# EasyEDA schematic SCH_zafir-project_2024-11-25.json
TITLE: Sheet_1; REV: 1.0; Date: 2024-11-25; Sheet: 1/1; Drawn By: muhammadzeeshan0668; Company: Your Company
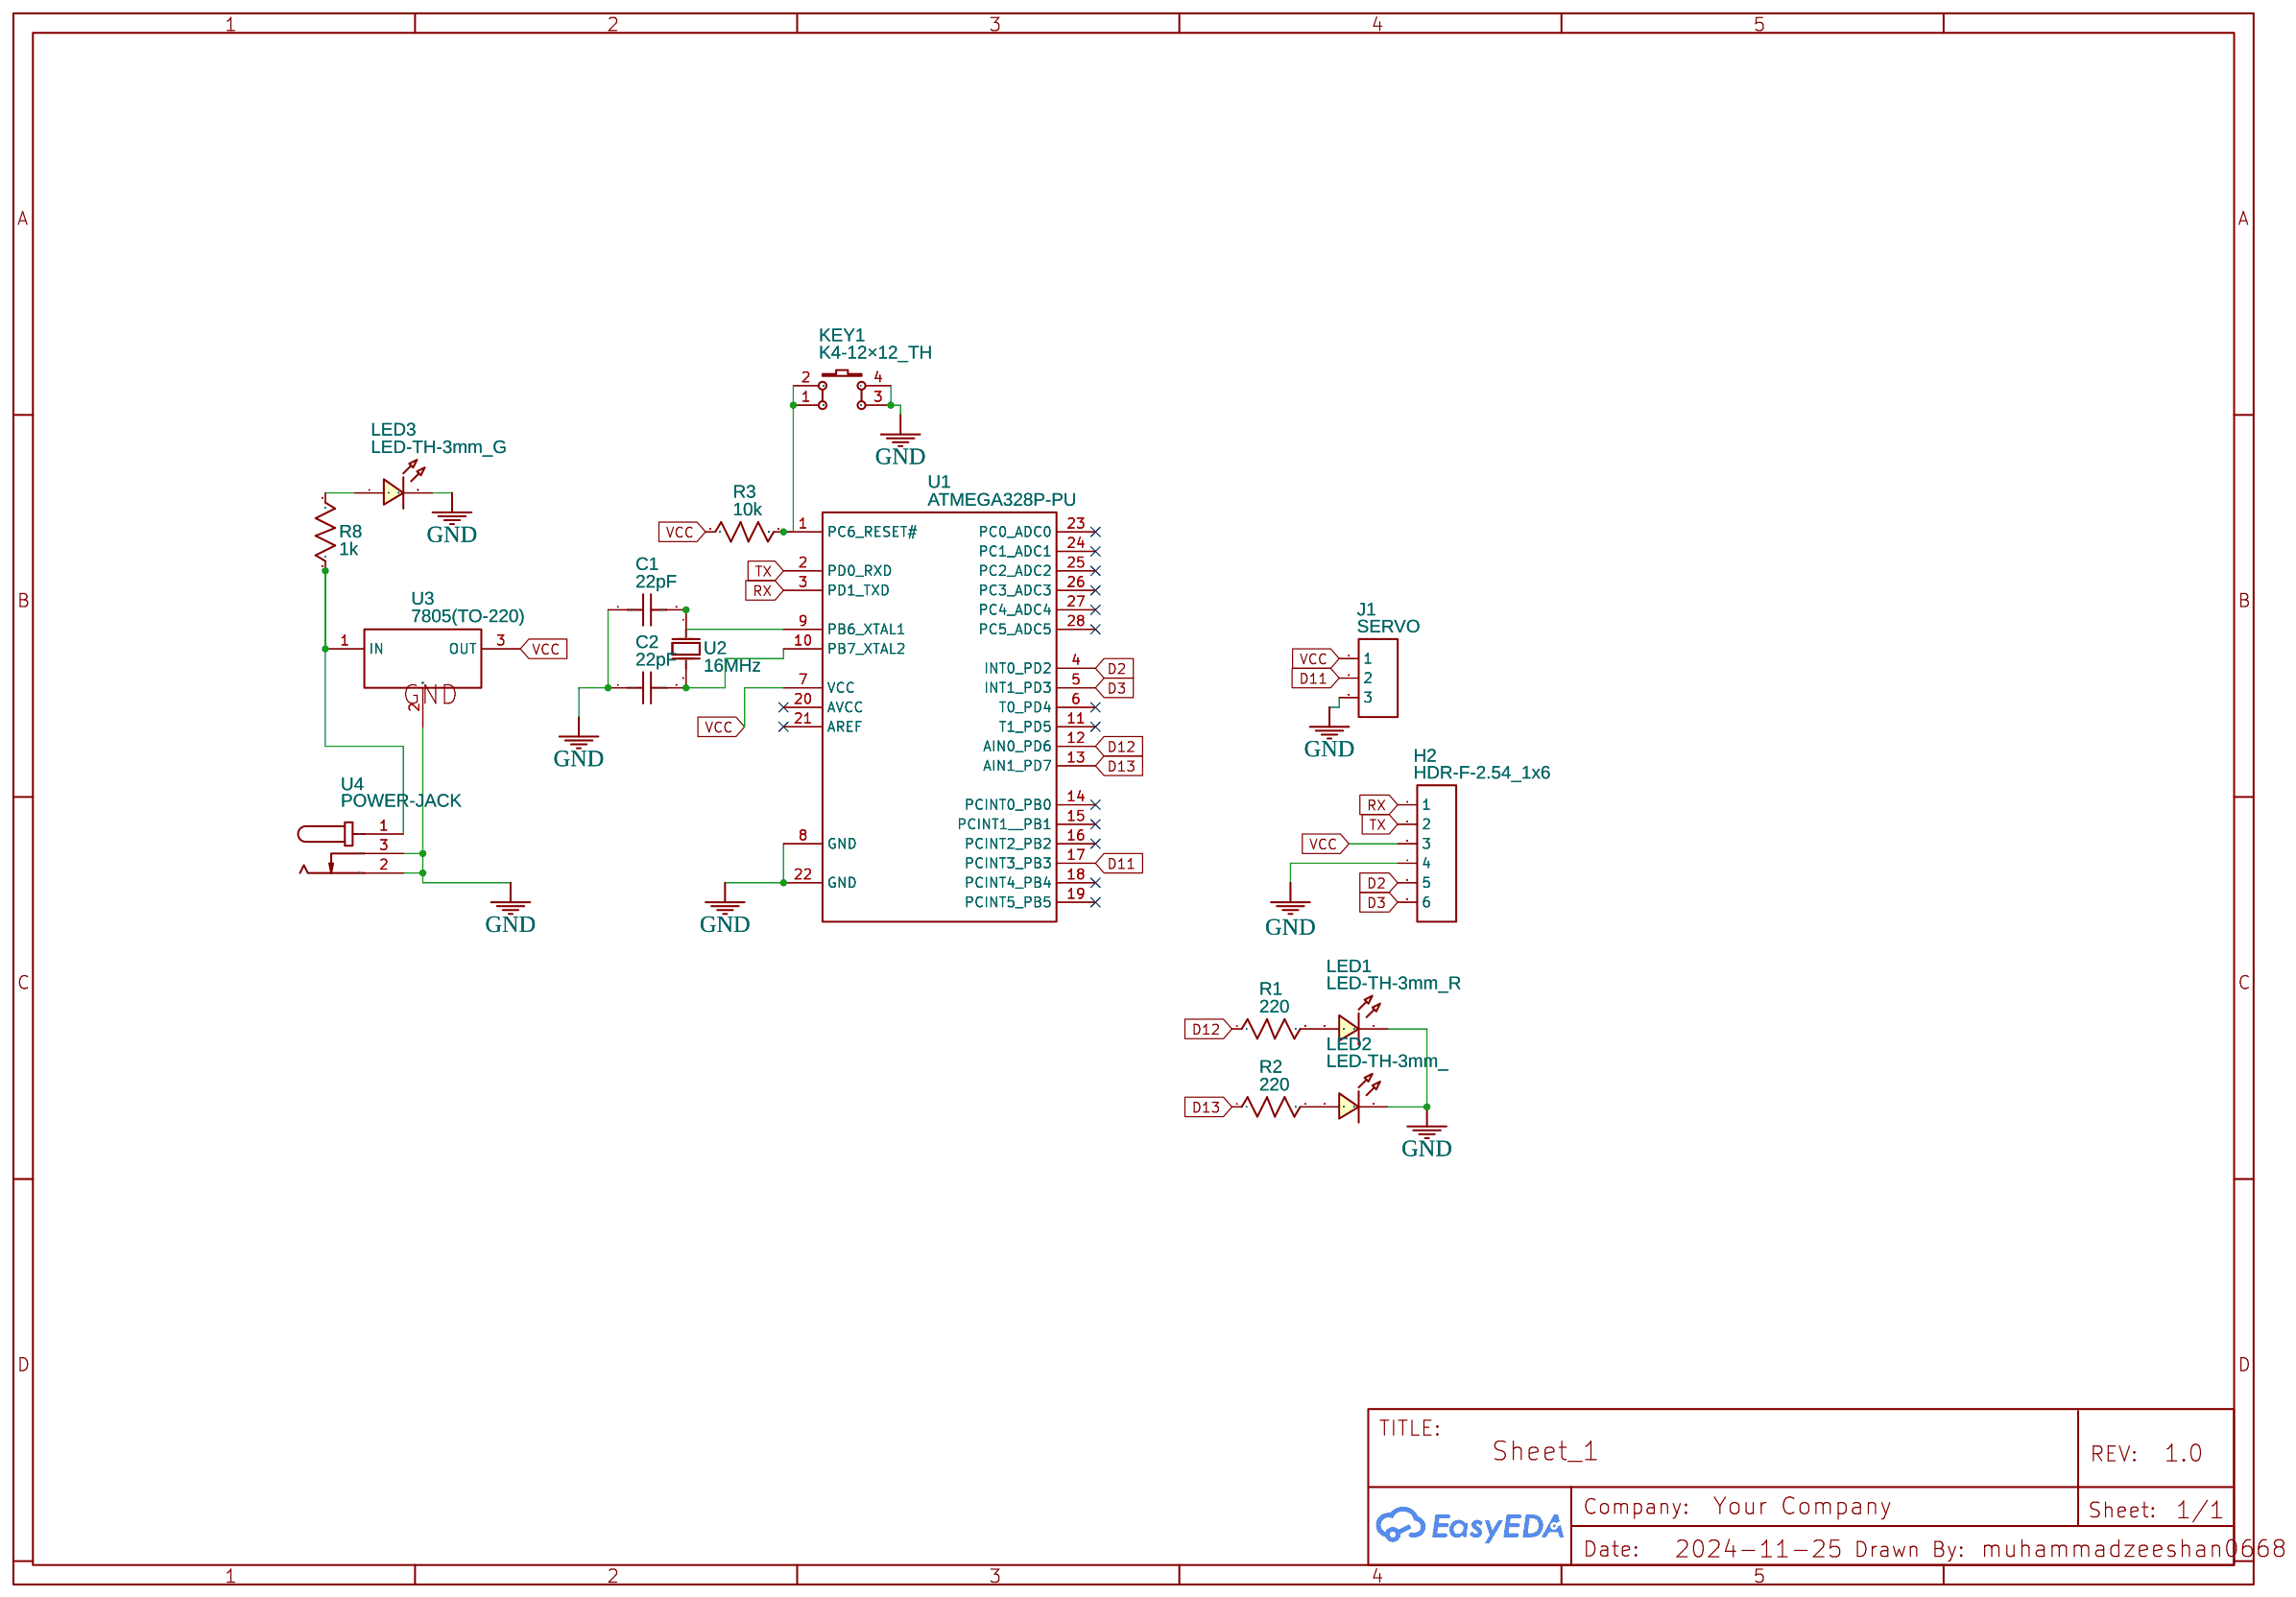
[diagram p0: schematic sheet]

## Parts
C1  22pF  [CAP-TH_L5.8-W2.4-P2.54-D0.6]
C2  22pF  [CAP-TH_L5.8-W2.4-P2.54-D0.6]
H2  HDR-F-2.54_1x6  [HDR-F-2.54_1X6]
J1  SERVO  [HDR-M-2.54_1X3]
KEY1  K4-12×12_TH  [KEY-TH_4P-L12.0-W12.0-P5.00-LS12.5]
LED1  LED-TH-3mm_R  [LED-TH_BD3.0_RED]
LED2  LED-TH-3mm_  [LED-TH_BD3.0_RED]
LED3  LED-TH-3mm_G  [LED-TH_BD3.0_GREEN]
R1  220  [R_AXIAL-0.4]
R2  220  [R_AXIAL-0.4]
R3  10k  [R_AXIAL-0.4]
R8  1k  [R_AXIAL-0.4]
U1  ATMEGA328P-PU  [DIP-28_L34.6-W7.3-P2.54-LS10.2-BL]
U2  16MHz  [HC-49US_L11.5-W4.5-P4.88]
U3  7805(TO-220)  [TO-220-3_L10.0-W4.5-P2.54-L]
U4  POWER-JACK  [DC-IN-TH_POWER-JACK]

## Library data of the parts
C1 C2 = CC1H220KA1EDCH4B1100: Contributor: lcsc; Supplier: LCSC; Supplier Part: C2832510; Manufacturer: Dersonic(德尔创); JLCPCB Part Class: Extended Part
H2 = HDR-F-2.54_1x6: Supplier Part: C40877; Supplier: LCSC; Contributor: LCEDA_Lib
J1 = HDR-M-2.54_1x3: Supplier Part: C180248; Supplier: LCSC; Contributor: LCEDA_Lib
KEY1 = K4-12×12_TH: Supplier Part: C128053; Supplier: LCSC; Manufacturer: 韩国韩荣; Manufacturer Part: K2-1103DP-M4SW-04; Contributor: LCEDA_Lib
LED1 LED2 = LED-TH-3mm_R: Manufacturer: EVERLIGHT(台湾亿光); Manufacturer Part: 204-10SDRD/S530-A3-L; Supplier Part: C84774; Supplier: LCSC; Contributor: LCEDA_Lib
LED3 = LED-TH-3mm_G: Manufacturer: EVERLIGHT(台湾亿光); Manufacturer Part: 204-10SYGD/S530-E3; Supplier Part: C85161; Contributor: LCEDA_Lib
R1-R3 R8 = R_AXIAL-0.4_US: Contributor: LCEDA_Lib
U1 = ATMEGA328P-PU: sourceId: Oic6oiASL; Contributor: LCSC; Supplier: LCSC; Manufacturer: MICROCHIP(美国微芯); Supplier Part: C33901; JLCPCB Part Class: Extended Part
U2 = HC49US-FF5F18-6.1440MHZ: Supplier: LCSC; Supplier Part: C6267208; Manufacturer: ILSI; JLCPCB Part Class: Extended Part; Contributor: lcsc
U3 = 7805(TO-220): Supplier: LCSC; Manufacturer: STMicroelectronics; Manufacturer Part: L7805CV-DG; Supplier Part: C3795; Contributor: LCEDA_Lib
U4 = POWER-JACK: Contributor: LCSC; Supplier: LCSC; Supplier Part: C9900001795; Manufacturer: 索峰; JLCPCB Part Class: Extended Part

## Nets
GND: C1.1 C2.1 H2.4 J1.3 KEY1.3 KEY1.4 LED1.2 LED2.2 LED3.2 U1.8(GND) U1.22(GND) U3.2(GND) U4.2 U4.3
VCC: H2.3 J1.1 R3.1 U1.7(VCC) U3.3(OUT)
D2: H2.5 U1.4(INT0 PD2)
D3: H2.6 U1.5(INT1 PD3)
D11: J1.2 U1.17(PCINT3 PB3)
D12: R1.1 U1.12(AIN0 PD6)
D13: R2.1 U1.13(AIN1 PD7)
RX: H2.1 U1.3(PD1 TXD)
TX: H2.2 U1.2(PD0 RXD)
Net-(C1-2): C1.2 U1.9(PB6 XTAL1) U2.1
Net-(C2-2): C2.2 U1.10(PB7 XTAL2) U2.2
Net-(KEY1-1): KEY1.1 KEY1.2 R3.2 U1.1(PC6 RESET#)
Net-(LED1-1): LED1.1 R1.2
Net-(LED2-1): LED2.1 R2.2
Net-(LED3-1): LED3.1 R8.2
Net-(R8-1): R8.1 U3.1(IN) U4.1

Not connected (* = marked no-connect by the designer): U1 6(T0 PD4)* 11(T1 PD5)* 14(PCINT0 PB0)* 15(PCINT1  PB1)* 16(PCINT2 PB2)* 18(PCINT4 PB4)* 19(PCINT5 PB5)* 20(AVCC)* 21(AREF)* 23(PC0 ADC0)* 24(PC1 ADC1)* 25(PC2 ADC2)* 26(PC3 ADC3)* 27(PC4 ADC4)* 28(PC5 ADC5)*
